# Altium project Sensors_PCB.PrjPCB
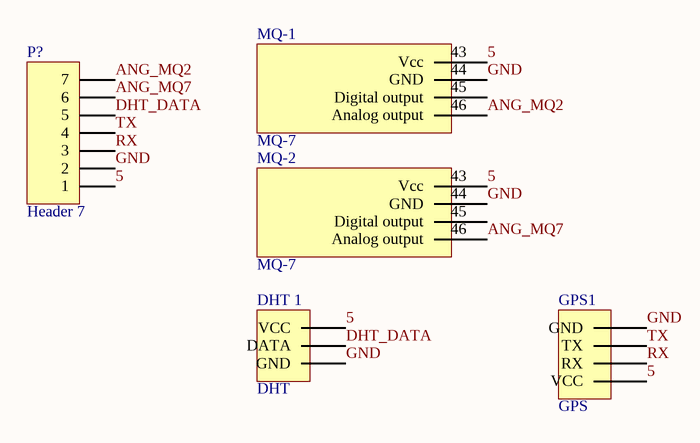
[diagram p0: Sensors_PCB.SchDoc]
1 sheet, 5 parts. Net scope: global (net labels, ports and power ports of the same name join across sheets).
Board file: Sensors_PCB.PcbDoc

## Sheet Sensors_PCB.SchDoc
size A

### Parts
Connector  Header 7  [HDR1X7]
DHT_1  DHT  [DHT]
GPS1  GPS  [GPS]
MQ-1  MQ-7  [MQ-7 Up]
MQ-2  MQ-7  [MQ-7 Up]

### Nets
5: Connector.1 DHT_1.9(VCC) GPS1.12(VCC) MQ-1.43(Vcc) MQ-2.43(Vcc)
ANG_MQ2: Connector.7 MQ-1.46(Analog_output)
ANG_MQ7: Connector.6 MQ-2.46(Analog_output)
DHT_DATA: Connector.5 DHT_1.10(DATA)
GND: Connector.2 DHT_1.11(GND) GPS1.15(GND) MQ-1.44(GND) MQ-2.44(GND)
RX: Connector.3 GPS1.13(RX)
TX: Connector.4 GPS1.14(TX)

Not connected (* = marked no-connect by the designer): MQ-1 45(Digital_output); MQ-2 45(Digital_output)

### Library data of the parts
Connector = Header 7: Header, 7-Pin